# Altium project TEC_driver.PrjPCB (part 2 of 2)

## Sheet TEC.SchDoc
size A3; SPICEModelCacheKPBCKGMN: <root> / <DocumentId>KPBCKGMN</DocumentId> / </root>
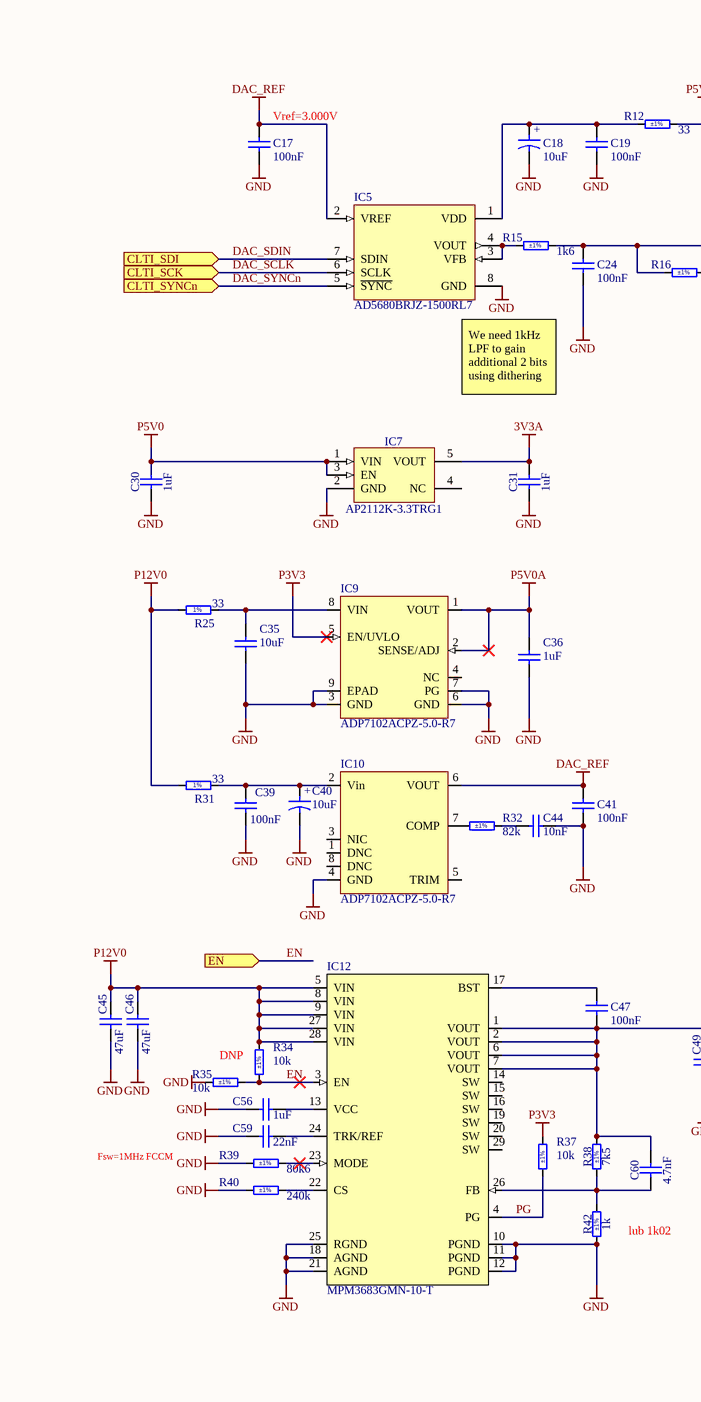
[diagram p2: TEC.SchDoc, left]
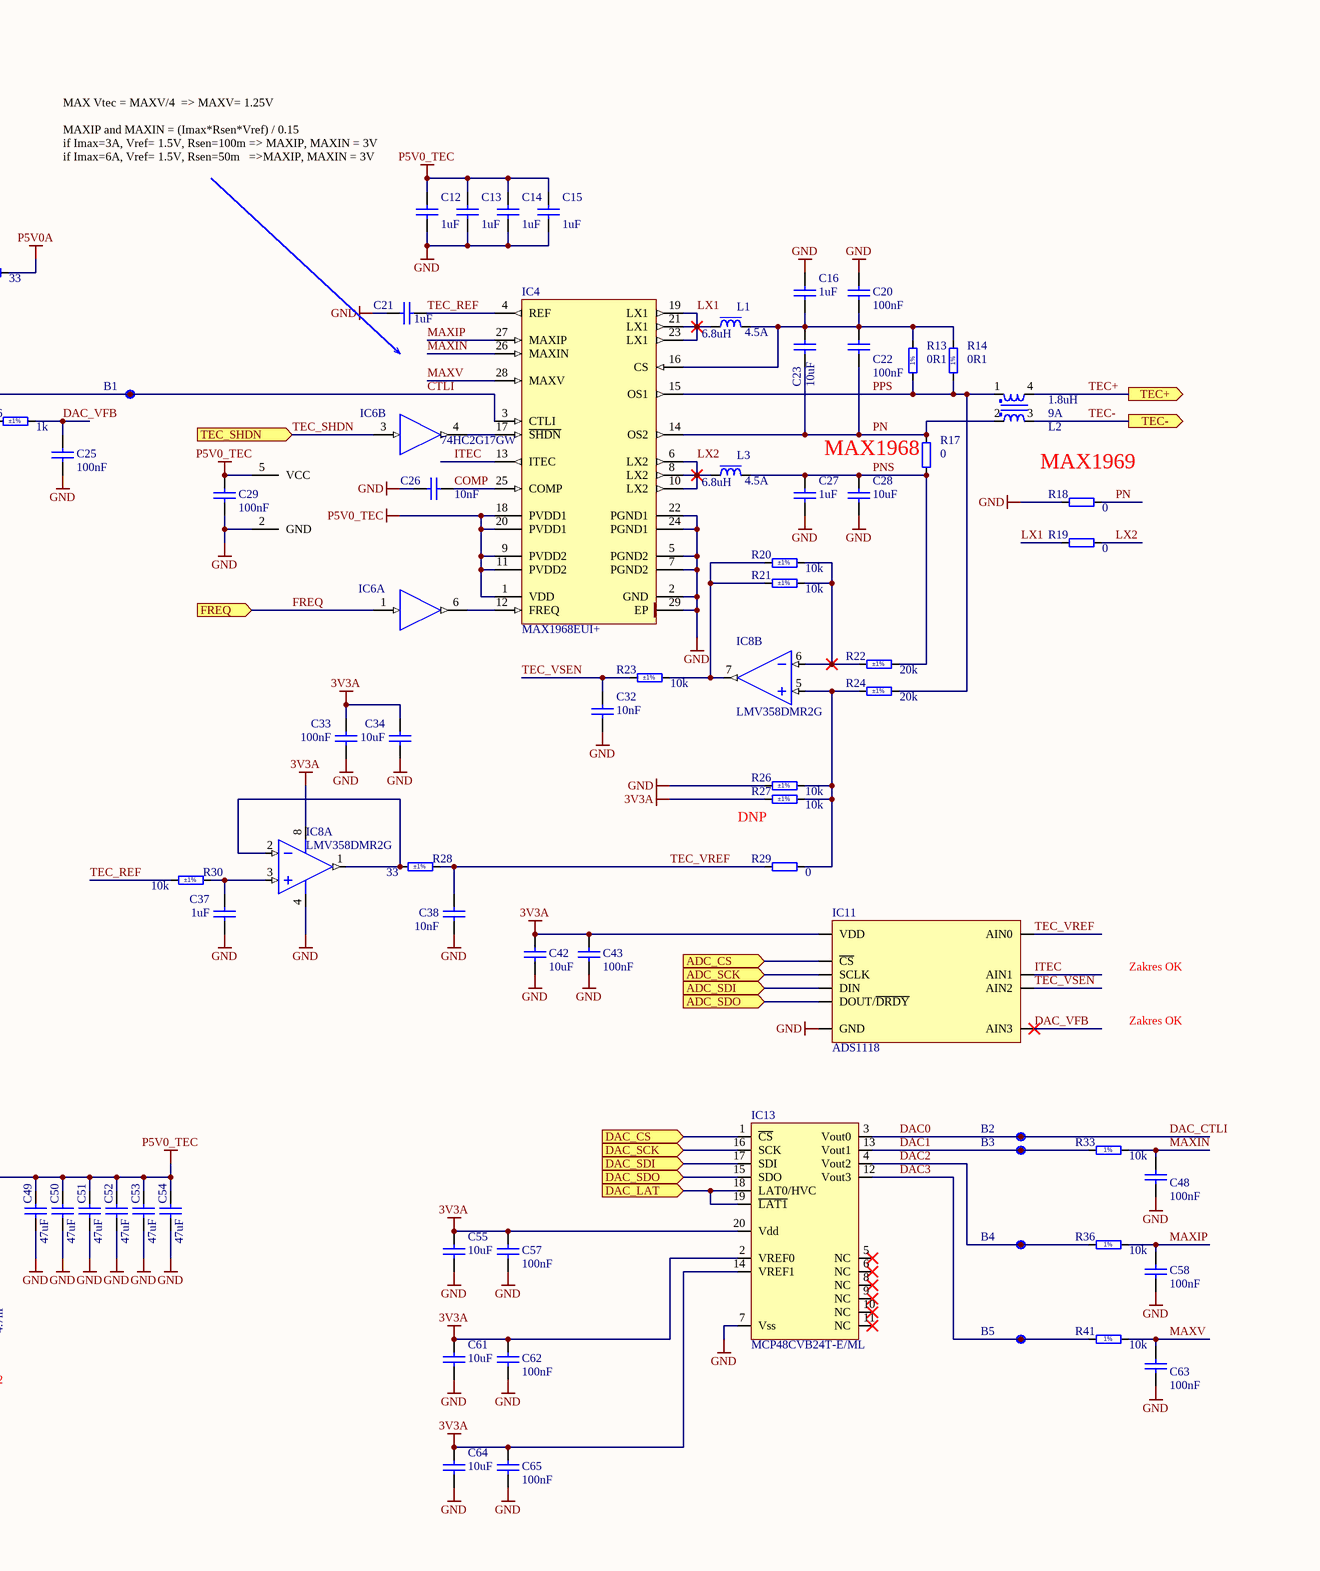
[diagram p3: TEC.SchDoc, right]

### Parts
B1  SMD Pad  [C100]  (value not drawn)
B2  SMD Pad  [C100]  (value not drawn)
B3  SMD Pad  [C100]  (value not drawn)
B4  SMD Pad  [C100]  (value not drawn)
B5  SMD Pad  [C100]  (value not drawn)
C12  1uF  [CAPC1005X55N]
C13  1uF  [CAPC1005X55N]
C14  1uF  [CAPC1005X55N]
C15  1uF  [CAPC1005X55N]
C16  1uF  [CAPC1005X55N]
C17  100nF  [CAPC1005X55N]
C18  10uF  [CAPMP3216X180N]
C19  100nF  [CAPC1005X55N]
C20  100nF  [CAPC1005X55N]
C21  1uF  [CAPC1005X55N]
C22  100nF  [CAPC1005X55N]
C23  10uF  [CAPC1709X100N]
C24  100nF  [CAPC1005X55N]
C25  100nF  [CAPC1005X55N]
C26  10nF  [CAPC1005X55N]
C27  1uF  [CAPC1005X55N]
C28  10uF  [CAPC1709X100N]
C29  100nF  [CAPC1005X55N]
C30  1uF  [CAPC1005X55N]
C31  1uF  [CAPC1005X55N]
C32  10nF  [CAPC1005X55N]
C33  100nF  [CAPC1005X55N]
C34  10uF  [CAPC1709X100N]
C35  10uF  [CAPC1709X100N]
C36  1uF  [CAPC1005X55N]
C37  1uF  [CAPC1005X55N]
C38  10nF  [CAPC1005X55N]
C39  100nF  [CAPC1005X55N]
C40  10uF  [CAPMP3216X180N]
C41  100nF  [CAPC1005X55N]
C42  10uF  [CAPC1709X100N]
C43  100nF  [CAPC1005X55N]
C44  10nF  [CAPC1005X55N]
C45  47uF  [CAPC3216X180N]
C46  47uF  [CAPC3216X180N]
C47  100nF  [CAPC1005X55N]
C48  100nF  [CAPC1005X55N]
C49  47uF  [CAPC3216X180N]
C50  47uF  [CAPC3216X180N]
C51  47uF  [CAPC3216X180N]
C52  47uF  [CAPC3216X180N]
C53  47uF  [CAPC3216X180N]
C54  47uF  [CAPC3216X180N]
C55  10uF  [CAPC1709X100N]
C56  1uF  [CAPC1005X55N]
C57  100nF  [CAPC1005X55N]
C58  100nF  [CAPC1005X55N]
C59  22nF  [CAPC1005X55N]
C60  4.7nF  [CAPC1005X55N]
C61  10uF  [CAPC1709X100N]
C62  100nF  [CAPC1005X55N]
C63  100nF  [CAPC1005X55N]
C64  10uF  [CAPC1709X100N]
C65  100nF  [CAPC1005X55N]
IC4  MAX1968EUI+  [SOP65P638X110-29N-R315X565]
IC5  AD5680BRJZ-1500RL7  [SOT65P280X145-8N]
IC6  74HC2G17GW  [SOT65P210X110-6N]  (value not drawn)  (parts A,B of 2)
IC7  AP2112K-3.3TRG1  [SOT95P285X140-5N]
IC8  LMV358DMR2G  [MSOP-8]  (parts A,B of 2)
IC9  ADP7102ACPZ-5.0-R7  [WFDFN-8]
IC10  ADP7102ACPZ-5.0-R7  [MSOP-8]
IC11  ADS1118  [VSSOP10]
IC12  MPM3683GMN-10-T  [MPM3683]
IC13  MCP48CVB24T-E/ML  [QFN20]
L1  6.8uH  Power: 4.5A  [INDM6965X300N]
L2  1.8uH  Power: 9A  [PA4339]
L3  6.8uH  Power: 4.5A  [INDM6965X300N]
R12  33  Tolerance: ±1%  [RESC1005X40N]
R13  0R1  [RESC3216X65N]
R14  0R1  [RESC3216X65N]
R15  1k6  Tolerance: ±1%  [RESC1005X40N]
R16  1k  Tolerance: ±1%  [RESC1005X40N]
R17  0  [RESC3116X80N]
R18  0  [RESC3116X80N]
R19  0  [RESC3116X80N]
R20  10k  Tolerance: ±1%  [RESC1005X40N]
R21  10k  Tolerance: ±1%  [RESC1005X40N]
R22  20k  Tolerance: ±1%  [RESC1005X40N]
R23  10k  Tolerance: ±1%  [RESC1005X40N]
R24  20k  Tolerance: ±1%  [RESC1005X40N]
R25  33  [RESC1005X40N]
R26  10k  Tolerance: ±1%  [RESC1005X40N]
R27  10k  Tolerance: ±1%  [RESC1005X40N]
R28  33  Tolerance: ±1%  [RESC1005X40N]
R29  0  [RESC1005X40N]
R30  10k  Tolerance: ±1%  [RESC1005X40N]
R31  33  [RESC1005X40N]
R32  82k  Tolerance: ±1%  [RESC1005X40N]
R33  10k  [RESC1005X40N]
R34  10k  Tolerance: ±1%  [RESC1005X40N]
R35  10k  Tolerance: ±1%  [RESC1005X40N]
R36  10k  [RESC1005X40N]
R37  10k  Tolerance: ±1%  [RESC1005X40N]
R38  7k5  Tolerance: ±1%  [RESC1005X40N]
R39  80k6  Tolerance: ±1%  [RESC1005X40N]
R40  240k  Tolerance: ±1%  [RESC1005X40N]
R41  10k  [RESC1005X40N]
R42  1k  Tolerance: ±1%  [RESC1005X40N]

### Ports
ADC_CS (in), ADC_SCK (in), ADC_SDI (in), ADC_SDO (in), CLTI_SCK (in), CLTI_SDI (in), CLTI_SYNCn (in), DAC_CS (in), DAC_LAT (in), DAC_SCK (in), DAC_SDI (in), DAC_SDO (in), EN (in), FREQ (in), TEC+ (out), TEC- (out), TEC_SHDN (in)

### Nets
3V3A: C31.2 C33.1 C34.2 C42.2 C43.1 C55.2 C57.1 C61.2 C62.1 C64.2 C65.1 IC7.5(VOUT) IC8.8(V+) IC11.8(VDD) IC13.2(VREF0) IC13.14(VREF1) IC13.20(Vdd) R27.1
DAC_REF: C17.1 C41.1 IC5.2(VREF) IC10.6(VOUT)
GND: C12.2 C13.2 C14.2 C15.2 C16.1 C17.2 C18.2 C19.2 C20.1 C21.2 C24.2 C25.2 C26.2 C27.2 C28.1 C29.2 C30.1 C31.1 C32.1 C33.2 C34.1 C35.1 C36.2 C37.2 C38.2 C39.2 C40.2 C41.2 C42.1 C43.2 C44.1 C45.1 C46.1 C48.2 C49.1 C50.1 C51.1 C52.1 C53.1 C54.1 C55.1 C56.2 C57.2 C58.2 C59.1 C61.1 C62.2 C63.2 C64.1 C65.2 IC4.2(GND) IC4.5(PGND2) IC4.7(PGND2) IC4.22(PGND1) IC4.24(PGND1) IC4.29(EP) IC5.8(GND) IC6.2(GND) IC7.2(GND) IC8.4(V-) IC9.3(GND) IC9.6(GND) IC9.7(PG) IC9.9(EPAD) IC10.4(GND) IC11.3(GND) IC12.10(PGND) IC12.11(PGND) IC12.12(PGND) IC12.18(AGND) IC12.21(AGND) IC12.25(RGND) IC13.7(Vss) R18.1 R26.1 R35.1 R39.1 R40.1 R42.1
P3V3: IC9.5(EN/UVLO) R37.2
P5V0: C30.2 IC7.1(VIN) IC7.3(EN)
P5V0_TEC: C12.1 C13.1 C14.1 C15.1 C29.1 C47.2 C49.2 C50.2 C51.2 C52.2 C53.2 C54.2 C60.2 IC4.1(VDD) IC4.9(PVDD2) IC4.11(PVDD2) IC4.18(PVDD1) IC4.20(PVDD1) IC6.5(VCC) IC12.1(VOUT) IC12.2(VOUT) IC12.6(VOUT) IC12.7(VOUT) R38.2
P5V0A: C36.1 IC9.1(VOUT) IC9.2(SENSE/ADJ) R12.2
P12V0: C45.2 C46.2 IC12.5(VIN) IC12.8(VIN) IC12.9(VIN) IC12.27(VIN) IC12.28(VIN) R25.1 R31.1 R34.2
VDD: IC6.5(VCC)
COMP: C26.1 IC4.25(COMP)
CS_ADC: IC11.2(~{CS}) ; port ADC_CS
CS_DAC: IC13.1(~{CS}) ; port DAC_CS
CTLI: B1.1 C24.1 IC4.3(CTLI) R15.2 R16.1
DAC0: B2.1 IC13.3(Vout0)  [also labelled DAC_CTLI]
DAC1: B3.1 IC13.13(Vout1) R33.1
DAC2: B4.1 IC13.4(Vout2) R36.1
DAC3: B5.1 IC13.12(Vout3) R41.1
DAC_SCLK: IC5.6(SCLK) IC11.1(SCLK) IC13.16(SCK) ; port DAC_SCK, port ADC_SCK, port CLTI_SCK
DAC_SDIN: IC5.7(SDIN) IC11.10(DIN) IC13.17(SDI) ; port DAC_SDI, port ADC_SDI, port CLTI_SDI
DAC_SYNCn: IC5.5(~{SYNC}) ; port CLTI_SYNCn  [project net CLTI_SYNCn]
DAC_VFB: C25.1 IC11.7(AIN3) R16.2
EN: IC12.3(EN) R34.1 R35.2 ; port EN
FREQ: IC6.1(IN) ; port FREQ
ITEC: IC4.13(ITEC) IC11.5(AIN1)
LAT_DAC: IC13.18(LAT0/HVC) IC13.19(~{LAT1}) ; port DAC_LAT
LX1: IC4.19(LX1) IC4.21(LX1) IC4.23(LX1) L1.1 R19.2
LX2: IC4.6(LX2) IC4.8(LX2) IC4.10(LX2) L3.1 R19.1
MAXIN: C48.1 IC4.26(MAXIN) R33.2
MAXIP: C58.1 IC4.27(MAXIP) R36.2
MAXV: C63.1 IC4.28(MAXV) R41.2
MISO_ADC: IC11.9(DOUT/~{DRDY}) ; port ADC_SDO
MISO_DAC: IC13.15(SDO) ; port DAC_SDO
PG: IC12.4(PG) R37.1
PN: C22.2 C23.1 IC4.14(OS2) L2.2 R17.2 R18.2
PNS: C27.1 C28.2 L3.2 R17.1 R22.2
PPS: IC4.15(OS1) L2.1 R13.1 R14.1 R24.2
TEC+: L2.4 ; port TEC+
TEC-: L2.3 ; port TEC-
TEC_REF: C21.1 IC4.4(REF) R30.2
TEC_SHDN: IC6.3(IN) ; port TEC_SHDN  [project net IO1]
TEC_VREF: C38.1 IC11.4(AIN0) R28.1 R29.1
TEC_VSEN: C32.2 IC11.6(AIN2) R23.1
NetC16_2: C16.2 C20.2 C22.1 C23.2 IC4.16(CS) L1.2 R13.2 R14.2
NetC18_1: C18.1 C19.1 IC5.1(VDD) R12.1
NetC35_2: C35.2 IC9.8(VIN) R25.2
NetC37_1: C37.1 IC8.3(IN1+) R30.1
NetC39_1: C39.1 C40.1 IC10.2(Vin) R31.2
NetC44_2: C44.2 R32.2
NetC47_1: C47.1 IC12.17(BST)
NetC56_1: C56.1 IC12.13(VCC)
NetC59_2: C59.2 IC12.24(TRK/REF)
NetC60_1: C60.1 IC12.26(FB) R38.1 R42.2
NetIC4_12: IC4.12(FREQ) IC6.6(OUT)
NetIC4_17: IC4.17(~{SHDN}) IC6.4(OUT)
NetIC5_3: IC5.3(VFB) IC5.4(VOUT) R15.1
NetIC8_1: IC8.1(OUT1) IC8.2(IN1-) R28.2
NetIC8_5: IC8.5(IN2+) R24.1 R26.2 R27.2 R29.2
NetIC8_6: IC8.6(IN2-) R20.2 R21.2 R22.1
NetIC8_7: IC8.7(OUT2) R20.1 R21.1 R23.2
NetIC10_7: IC10.7(COMP) R32.1
NetIC12_22: IC12.22(CS) R40.2
NetIC12_23: IC12.23(MODE) R39.2

Not connected (* = marked no-connect by the designer): IC7 4(NC); IC9 4(NC); IC10 1(DNC) 3(NIC) 5(TRIM) 8(DNC); IC12 14(SW) 15(SW) 16(SW) 19(SW) 20(SW) 29(SW); IC13 5(NC)* 6(NC)* 8(NC)* 9(NC)* 10(NC)* 11(NC)*

### Notes on the sheet
- MAX Vtec = MAXV/4  => MAXV= 1.25V
- MAXIP and MAXIN = (Imax*Rsen*Vref) / 0.15
- if Imax=3A, Vref= 1.5V, Rsen=100m => MAXIP, MAXIN = 3V
- if Imax=6A, Vref= 1.5V, Rsen=50m   =>MAXIP, MAXIN = 3V
- (near C17) Vref=3.000V
- (near R17) MAX1968
- MAX1969
- We need 1kHz LPF to gain additional 2 bits using dithering
- DNP
- Zakres OK
- Fsw=1MHz FCCM
- lub 1k02
- (in symbol CTE3216-18_10UF_16V_20%_AVX_TCJ) +
- (in symbol R0402_10K_1%_0.0625W_100PPM) 1%
- (in symbol R0402_33R_1%_0.0625W_100PPM) 1%
- (in symbol R1206_0R1_1%_0.25W_100PPM_YAGEO_PT) 1%

### Library data of the parts
B1-B5 = SMD_PAD_D1MM: Through Hole Pad; Part Description: 1mm Diameter SMD Pad; Mounted: No; Part Number: SMD_PAD_D1MM; Component Kind: Standard (No BOM); Component Type: Standard (No BOM); Pin Count: 1; Family: SMD Pad; Socket: No; SMD: No; Sense: No; Status: None; ComponentHeight: 0mm; HelpURL: Undefined; Author: CERN DEM JLC; CreateDate: 10.10.2017; LatestRevisionDate: 10.10.2017; PackageDescription: 1mm Diameter SMD Pad
C12-C16 C21 C27 C36 C37 C56 = CC0402_1UF_25V_10%_X5R: Non-polarised capacitor; Part Description: SMD Multilayer Chip Ceramic Capacitor; Manufacturer: GENERIC; Manufacturer1 Part Number: C1005X5R1E105K050; Voltage: 25V; TC: X5R; Tolerance: ±10%; Part Number: CC0402_1UF_25V_10%_X5R; Component Kind: Standard; Component Type: Standard; Pin Count: 2; Value: 1uF; Status: Preferred; Manufacturer Part Number: CC0402_1UF_25V_10%_X5R; Case: 0402; Mounted: Yes; Socket: No; SMD: Yes; Sense: No; Manufacturer1 Example: TDK; Manufacturer1 ComponentHeight: 0.55mm; HelpURL: \\cern.ch\dfs\Applications\Altium\Datasheets\CC0402_X5R_TDK_C.pdf; Author: CERN DEM BC; CreateDate: 17.02.2020; LatestRevisionDate: 17.02.2020
C17 C19 C20 C22 C24 C25 C29 C33 C39 C41 C43 C47 C48 C57 C58 C62 C63 C65 = CC0402_100NF_16V_10%_X5R: Non-polarised capacitor; Part Description: SMD Multilayer Chip Ceramic Capacitor; Manufacturer: GENERIC; Manufacturer1 Part Number: GRM155R61C104KA88D; Voltage: 16V; TC: X5R; Tolerance: ±10%; Table: Capacitors SMD; Part Number: CC0402_100NF_16V_10%_X5R; Component Kind: Standard; Component Type: Standard; Pin Count: 2; Value: 100nF; Status: None; Manufacturer Part Number: CC0402_100NF_16V_10%_X5R; Case: 0402; Mounted: Yes; Socket: No; SMD: Yes; Manufacturer1 Example: MURATA; Manufacturer1 ComponentHeight: 0.55mm; HelpURL: \\cern.ch\dfs\Applications\Altium\Datasheets\CC0402_X5R_MURATA_GRM.pdf; Author: CERN DEM JLC; CreateDate: 2013-12-10; LatestRevisionDate: 2013-12-10
C18 C40 = CTE3216-18_10UF_16V_20%_AVX_TCJ: Polarised capacitor; Part Description: ESR 0R200 Tantalum Solid Electrolytic Chip Capacitor with Conductive Polymer Electrode; Manufacturer: AVX; Manufacturer Part Number: TCJA106M016R0200; Voltage: 16V; Tolerance: ±20%; Part Number: CTE3216-18_10UF_16V_20%_AVX_TCJ; Component Kind: Standard; Component Type: Standard; Pin Count: 2; Value: 10uF; Status: Preferred; Case: A; Mounted: Yes; Socket: No; SMD: Yes; Sense: No; ComponentHeight: 1.8mm; HelpURL: \\cern.ch\dfs\Applications\Altium\Datasheets\CTE_AVX_TCJ.pdf; Author: CERN DEM JLC; CreateDate: 29.03.2012; LatestRevisionDate: 29.03.2012
C23 C28 C34 C35 C42 C55 C61 C64 = CC0603_10UF_6.3V_20%_X7R_SAMSUNG_CL: Non-polarised capacitor; Part Description: SMD Multilayer Chip Ceramic Capacitor; Manufacturer: SAMSUNG ELECTRO-MECHANICS; Manufacturer Part Number: CL10B106MQ8NR; Voltage: 6.3V; TC: X7R; Tolerance: ±20%; Part Number: CC0603_10UF_6.3V_20%_X7R_SAMSUNG_CL; Component Kind: Standard; Component Type: Standard; Pin Count: 2; Value: 10uF; Status: Not Recommended; Case: 0603; Mounted: Yes; Socket: No; SMD: Yes; Sense: No; ComponentHeight: 1mm; HelpURL: \\cern.ch\dfs\Applications\Altium\Datasheets\CC0603_X7R_SAMSUNG_CL10B106MQ8NR.pdf; Author: CERN DEM BC; CreateDate: 12.10.2020; LatestRevisionDate: 12.10.2020
C26 C32 C38 C44 = CC0402_10NF_50V_10%_X7R: Non-polarised capacitor; Part Description: SMD Multilayer Chip Ceramic Capacitor; Manufacturer: GENERIC; Manufacturer1 Part Number: GRM155R71H103KA88D; Voltage: 50V; TC: X7R; Tolerance: ±10%; Part Number: CC0402_10NF_50V_10%_X7R; Component Kind: Standard; Component Type: Standard; Pin Count: 2; Value: 10nF; Status: None; Manufacturer Part Number: CC0402_10NF_50V_10%_X7R; Case: 0402; Mounted: Yes; Socket: No; SMD: Yes; Sense: No; Manufacturer1 Example: MURATA; Manufacturer1 ComponentHeight: 0.55mm; HelpURL: \\cern.ch\dfs\Applications\Altium\Datasheets\CC0402_X7R_MURATA_GRM.pdf; Author: CERN DEM MR; CreateDate: 08.01.2016; LatestRevisionDate: 08.01.2016
C30 C31 = CC0402_1UF_16V_10%_X5R: Non-polarised capacitor; Part Description: SMD Multilayer Chip Ceramic Capacitor; Manufacturer: GENERIC; Manufacturer1 Part Number: C1005X5R1C105KT; Voltage: 16V; TC: X5R; Tolerance: ±10%; Part Number: CC0402_1UF_16V_10%_X5R; Component Kind: Standard; Component Type: Standard; Pin Count: 2; Value: 1uF; Status: Preferred; Manufacturer Part Number: CC0402_1UF_16V_10%_X5R; Case: 0402; Mounted: Yes; Socket: No; SMD: Yes; Sense: No; Manufacturer1 Example: TDK; Manufacturer1 ComponentHeight: 0.55mm; HelpURL: \\cern.ch\dfs\Applications\Altium\Datasheets\CC0402_X5R_TDK_C.pdf; Author: CERN DEM JLC; CreateDate: 25.10.2012; LatestRevisionDate: 25.10.2012
C45 C46 C49-C54 = CC1206_47UF_25V_20%_X5R: Non-polarised capacitor; Part Description: SMD Multilayer Chip Ceramic Capacitor; Manufacturer: GENERIC; Manufacturer1 Part Number: C3216X5R1E476M160; Voltage: 25V; TC: X5R; Tolerance: ±20%; Part Number: CC1206_47UF_25V_20%_X5R; Component Kind: Standard; Component Type: Standard; Pin Count: 2; Value: 47uF; Status: None; Manufacturer Part Number: CC1206_47UF_25V_20%_X5R; Case: 1206; Mounted: Yes; Socket: No; SMD: Yes; Sense: No; Manufacturer1 Example: TDK; Manufacturer1 ComponentHeight: 1.8mm; HelpURL: \\cern.ch\dfs\Applications\Altium\Datasheets\CC1206_X5R_TDK_C.pdf; Author: CERN DEM JLC; CreateDate: 20.11.2013; LatestRevisionDate: 14.03.2017
C59 = CC0402_22NF_50V_5%_X7R: Non-polarised capacitor; Part Description: SMD Multilayer Chip Ceramic Capacitor; Manufacturer: GENERIC; Manufacturer1 Part Number: C0402C223J5RAC; Voltage: 50V; TC: X7R; Tolerance: ±5%; Part Number: CC0402_22NF_50V_5%_X7R; Component Kind: Standard; Component Type: Standard; Pin Count: 2; Value: 22nF; Status: Preferred; Manufacturer Part Number: CC0402_22NF_50V_5%_X7R; Case: 0402; Mounted: Yes; Socket: No; SMD: Yes; Sense: No; Manufacturer1 Example: KEMET; Manufacturer1 ComponentHeight: 0.55mm; HelpURL: \\cern.ch\dfs\Applications\Altium\Datasheets\CC0402_X7R_KEMET.pdf; Author: CERN DEM BC; CreateDate: 15.07.2020; LatestRevisionDate: 15.07.2020
C60 = CC0402_4.7NF_16V_10%_X7R: Non-polarised capacitor; Part Description: SMD Multilayer Chip Ceramic Capacitor; Manufacturer: GENERIC; Manufacturer1 Part Number: 223878715632; Voltage: 16V; TC: X7R; Tolerance: ±10%; Part Number: CC0402_4.7NF_16V_10%_X7R; Component Kind: Standard; Component Type: Standard; Pin Count: 2; Value: 4.7nF; Status: Not Recommended; Manufacturer Part Number: CC0402_4.7NF_16V_10%_X7R; Case: 0402; Mounted: Yes; Socket: No; SMD: Yes; Sense: No; Manufacturer1 Example: PHYCOMP; Manufacturer1 ComponentHeight: 0.55mm; HelpURL: \\cern.ch\dfs\Applications\Altium\Datasheets\CC0402_X7R_PHYCOMP.pdf; Author: CERN DEM JLC; CreateDate: 03.12.2007; LatestRevisionDate: 03.12.2007
IC4 = MAX1968EUI+: Power Drivers for Peltier TEC Modules; Manufacturer: MAXIM; PressFit: No; Bonding: No; Part Number: MAX1968EUI+; Component Kind: Standard; Component Type: Standard; Device: MAX1968EUI+; PackageDescription: SOP, 0.65mm Pitch; 28 Pin, 4.40mm W X 9.75mm L X 1.10mm H body (w/Thermal Tab 3.15 X 5.65mm), IPC Medium Density; Part Description: Power Drivers for Peltier TEC Modules; Manufacturer Part Number: MAX1968EUI; Pin Count: 29; Case: TSSOP28; Mounted: Yes; Socket: No; SMD: Yes; Sense: No; ComponentHeight: 1.1mm; Author: CERN DEM BC; HelpURL: \\cern.ch\dfs\Applications\Altium\Datasheets\MAX1968EUI+.pdf; CreateDate: 01.04.2021; LatestRevisionDate: 04.04.2022
IC5 = DAC_AD5680BRJZ: 5V 18-Bit nanoDAC®in a SOT-23; Manufacturer: ANALOG DEVICES; PressFit: No; Bonding: No; Part Number: AD5680BRJZ-1500RL7; Component Kind: Standard; Component Type: Standard; Device: AD5680BRJZ-1500RL7; Footprint: TSOP65P280X145-8N; PackageDescription: TSOP, 8-Leads, Body 2,90x1,60mm, Pitch 0,65mm, IPC Medium Density; Part Description: 5V 18-Bit nanoDAC®in a SOT-23; Manufacturer Part Number: AD5680BRJZ-1500RL7; Pin Count: 17; Case: SOT-23-8; Mounted: Yes; Socket: No; SMD: Yes; Sense: No; ComponentHeight: 0.8mm; Author: GK; HelpURL: \\cern.ch\dfs\Applications\Altium\Datasheets\AD5686BCPZ.pdf; CreateDate: 21.08.2017; LatestRevisionDate: 21.08.2017
IC6 = 74HC2G17GW: Dual Schmitt-Trigger Buffer; Part Description: Dual non-inverting Schmitt trigger; Manufacturer: NEXPERIA; PressFit: No; Bonding: No; Part Number: 74HC2G17GW; Component Kind: Standard; Component Type: Standard; Device: 74HC2G17GW; PackageDescription: SOT363, SC70-6, 0.65mm Pitch; 6 pin, 1.25mm W X 2.00mm L X 1.10mm H body, IPC Medium Density; Manufacturer Part Number: 74HC2G17GW; Pin Count: 6; Case: SOT363; Mounted: Yes; Socket: No; SMD: Yes; Sense: No; ComponentHeight: 1.1mm; Author: CERN DEM HF; HelpURL: \\cern.ch\dfs\Applications\Altium\Datasheets\74HC2G17.pdf; CreateDate: 31.10.2023; LatestRevisionDate: 31.10.2023
IC7 = AP2112K-3.3TRG1: 600mA CMOS Low Dropout Linear Regulator with Enable; Part Description: 3.3V 600mA CMOS Low Dropout Linear Regulator with Enable; Manufacturer: DIODES INCORPORATED; PressFit: No; Bonding: No; Part Number: AP2112K-3.3TRG1; Component Kind: Standard; Component Type: Standard; Device: AP2112K-3.3TRG1; PackageDescription: SOT23, 0.95mm Pitch; 5 Pin, 1.6mm W X 3.0mm L X 1.40mm H body, IPC Medium Density; Manufacturer Part Number: AP2112K-3.3; Pin Count: 5; Case: SOT25; Mounted: Yes; Socket: No; SMD: Yes; Sense: No; ComponentHeight: 1.4mm; HelpURL: \\cern.ch\dfs\Applications\Altium\Datasheets\AP2112K-3.3TRG1.pdf; Author: CERN DEM MR; CreateDate: 13.12.2017; LatestRevisionDate: 27.06.2022
IC8 = LMV358DMR2G: Voltage Feedback Amplifier 2 Circuit Rail-to-Rail 8-MSOP; Manufacture: onsemi; Parameter1: Bandwidth; Parameter2: Vmax; Shop1: Digi-Key; Shop1ID: LMV358DMR2GOSTR-ND; Value1: 1MHz; Value2: 5.5V; ComponentSymbol: LMV358DMR2G; ComponentType: IC OPAMP; DafaultFootprint: MSOP-8; MTBF: *; MTTF: *; ComponentLink3Description: DataSheet; ComponentLink3URL: https://www.onsemi.com/pdf/datasheet/lmv321-d.pdf
IC9 = ADP7102ACPZ-5.0-R7: Linear Voltage Regulator IC Positive Fixed 1 Output 300mA 8-LFCSP-WD (3x3); Manufacture: Analog Devices; Tolerance1: ± %; Value1: 3.3V to 20.0V; Assembly: SMD; Value2: 5.0V; Parameter1: Input Range; Parameter2: Output Voltage; Parameter3: Output Current; ComponentLink1URL: https://www.analog.com/media/en/technical-documentation/data-sheets/ADP7102.pdf; ComponentLink1Description: Datasheet; Shop1: *; Shop1ID: *; ComponentType: *; DafaultFootprint: WFDFN-8; Replacement: *; ComponentSymbol: ADP7102ACPZ-5.0-R7; Tolerance2: ± %; Value3: 300mA
IC10 = ADR433ARMZ: Series Voltage Reference IC Fixed 3V V ±0.13% 30 mA 8-MSOP; Manufacture: Analog Devices; Tolerance1: ± %; Value1: 3.3V to 20.0V; DafaultFootprint: WFDFN-8; Assembly: SMD; Value2: 5.0V; Parameter1: Input Range; Parameter2: Output Voltage; Value3: 300mA; Parameter3: Output Current; ComponentLink1URL: https://www.analog.com/media/en/technical-documentation/data-sheets/ADP7102.pdf; ComponentLink1Description: Datasheet; Shop1: *; Shop1ID: *; ComponentType: *; Replacement: *; ComponentSymbol: ADP7102ACPZ-5.0-R7; Tolerance2: ± %
IC11 = ADS1118: ADS1118 Ultrasmall, Low-Power, SPI™-Compatible, 16-Bit  Analog-to-Digital Converter with Internal Reference and Temperature Sensor; Manufacture: TexasInstruments; Assembly: SMD; DafaultFootprint: VSSOP-10; X2QFN-10; Parameter1: Resolution; Value1: 16bit; ComponentLink1Description: Datasheet; ComponentLink1URL: http://www.ti.com/lit/ds/symlink/ads1118.pdf; ComponentLink2Description: AplicationNote; ComponentSymbol: ADS1118; ComponentType: IC ADC
IC12 = MPM3683GMN-10-T: Non-Isolated PoL Module DC DC Converter 1 Output 0.6 ~ 5.5V 10A 2.7V - 16V Input; Manufacture: Monolithic Power Systems Inc.; Assembly: SMD; DafaultFootprint: 29-LGA Module; Parameter1: Input Voltage; Parameter2: Iout; Parameter3: Vin; Replacement: Vout; Shop1: Digi-Key; Shop1ID: 1589-MPM3683GMN-10-T-ND; Value3: 0.6-5.5V; ComponentLink1Description: Datasheet; ComponentLink1URL: https://www.monolithicpower.com/en/documentview/productdocument/index/version/2/document_type/Datasheet/lang/en/sku/MPM3683GMN-10/document_id/9917/; ComponentSymbol: MPM3683GMN-10-T; ComponentType: IC; Tolerance1: *; Tolerance2: *; Value1: 2.7V-16V; Value2: 10A
IC13 = MCP48CVB24T-E/ML: 12 Bit Digital to Analog Converter 4 20-QFN (4x4); Manufacture: Microchip; Tolerance1: ± %; Value1: 12bit; Shop1: Digi-Key; Shop1ID: 150-MCP48CVB24T-E/MLTR-ND; Assembly: SMD; Value2: 2.7-5.5V; Parameter1: Resolution; Parameter2: Operation voltage; ComponentLink1URL: https://mm.digikey.com/Volume0/opasdata/d220001/medias/docus/4284/MCP48CxBx4_8_2021.pdf; ComponentLink1Description: Datasheet; ComponentType: IC; DafaultFootprint: 20-QFN; Replacement: *; ComponentSymbol: MCP48CVB24T-E/ML; Tolerance2: ± %
L1 L3 = IND2525_6.8UH_20%_VISHAY_IHLP-2525CZ-01: Inductor With Core; Part Description: Low Profile, High Current IHLP® Inductor; Manufacturer: VISHAY DALE; Manufacturer Part Number: IHLP2525CZER6R8M01; Resistance: 0.054R; Tolerance: ±20%; Part Number: IND2525_6.8UH_20%_VISHAY_IHLP-2525CZ-01; Component Kind: Standard; Component Type: Standard; Pin Count: 2; Value: 6.8uH; Status: None; Case: 2525; Mounted: Yes; Socket: No; SMD: Yes; Sense: No; ComponentHeight: 3mm; HelpURL: \\cern.ch\dfs\Applications\Altium\Datasheets\IND2525_VISHAY_IHLP-2525CZ-01.pdf; Author: CERN DEM MR; CreateDate: 29/06/2017; LatestRevisionDate: 29/06/2017
L2 = PA4339.101NLT: 1.8 µH @ 100 kHz 2 Line Common Mode Choke Surface Mount 140 Ohms @ 100 MHz 9A DCR 10mOhm; Part Description: Line Filter, Common Mode Choke; Manufacturer: PULSE; Resistance: 0.010R; Tolerance: ±50%; Part Number: PA4339.101NLT; Component Kind: Standard; Component Type: Standard; Footprint: IND_PULSE_PA4339; Pin Count: 4; Value: 1.8uH; Status: None; Manufacturer Part Number: PA4339.101NLT; Mounted: Yes; Socket: No; SMD: Yes; Sense: No; ComponentHeight: 3.8; HelpURL: \\cern.ch\dfs\Applications\Altium\Datasheets\IND_BOURNS_SRF0504.pdf; Author: GK; CreateDate: 07/08/2017; LatestRevisionDate: 07/08/2017; Parameter 1: *
R12 R25 R28 R31 = R0402_33R_1%_0.0625W_100PPM: Resistor - 1%; Part Description: General Purpose Thick Film Chip Resistor; Manufacturer: GENERIC; Manufacturer1 Part Number: 232270673309L; TC: ±100ppm/°C; PressFit: No; Part Number: R0402_33R_1%_0.0625W_100PPM; Component Kind: Standard; Component Type: Standard; Pin Count: 2; Value: 33; Status: Not Recommended; Power: 0.0625W; Manufacturer Part Number: R0402_33R_1%_0.0625W_100PPM; Case: 0402; Mounted: Yes; Sense: No; Socket: No; SMD: Yes; Manufacturer1 Example: YAGEO PHYCOMP; Manufacturer1 ComponentHeight: 0.4mm; HelpURL: \\cern.ch\dfs\Applications\Altium\Datasheets\R0402_Phycomp_RC0402.pdf; Author: CERN DEM JLC
  R12 R28: CreateDate: 03.12.2007; LatestRevisionDate: 17.10.2012
  R25 R31: Tolerance: ±1%; CreateDate: 03/12/2007; LatestRevisionDate: 17/10/2012
R13 R14 = R1206_0R1_1%_0.25W_100PPM_YAGEO_PT: Resistor - 1%; Part Description: Current Sensor, Low TCR Chip Resistor; Manufacturer: YAGEO PHYCOMP; Manufacturer Part Number: PT1206FR-070R1L; Power: 0.25W; TC: ±100ppm/°C; PressFit: No; Part Number: R1206_0R1_1%_0.25W_100PPM_YAGEO_PT; Component Kind: Standard; Component Type: Standard; Pin Count: 2; Value: 0R1; Status: None; Tolerance: ±1%; Case: 1206; Mounted: Yes; Sense: No; Socket: No; SMD: Yes; ComponentHeight: 0.65mm; HelpURL: \\cern.ch\dfs\Applications\Altium\Datasheets\R1206_YAGEO_PT.pdf; Author: CERN DEM JMW; CreateDate: 06/07/2015; LatestRevisionDate: 06/07/2015
R15 = R0402_1K6_1%_0.0625W_100PPM: Resistor - 1%; Part Description: General Purpose Thick Film Chip Resistor; Manufacturer: GENERIC; Manufacturer1 Part Number: 232270671602L; TC: ±100ppm/°C; PressFit: No; Part Number: R0402_1K6_1%_0.0625W_100PPM; Component Kind: Standard; Component Type: Standard; Pin Count: 2; Value: 1k6; Status: Not Recommended; Power: 0.0625W; Manufacturer Part Number: R0402_1K6_1%_0.0625W_100PPM; Case: 0402; Mounted: Yes; Sense: No; Socket: No; SMD: Yes; Manufacturer1 Example: YAGEO PHYCOMP; Manufacturer1 ComponentHeight: 0.4mm; HelpURL: \\cern.ch\dfs\Applications\Altium\Datasheets\R0402_Phycomp_RC0402.pdf; Author: CERN DEM JLC; CreateDate: 03.12.2007; LatestRevisionDate: 17.10.2012
R16 R42 = R0402_1K_1%_0.0625W_100PPM: Resistor - 1%; Part Description: General Purpose Thick Film Chip Resistor; Manufacturer: GENERIC; Manufacturer1 Part Number: 232270671002L; TC: ±100ppm/°C; PressFit: No; Part Number: R0402_1K_1%_0.0625W_100PPM; Component Kind: Standard; Component Type: Standard; Pin Count: 2; Value: 1k; Status: Not Recommended; Power: 0.0625W; Manufacturer Part Number: R0402_1K_1%_0.0625W_100PPM; Case: 0402; Mounted: Yes; Sense: No; Socket: No; SMD: Yes; Manufacturer1 Example: YAGEO PHYCOMP; Manufacturer1 ComponentHeight: 0.4mm; HelpURL: \\cern.ch\dfs\Applications\Altium\Datasheets\R0402_Phycomp_RC0402.pdf; Author: CERN DEM JLC; CreateDate: 03.12.2007; LatestRevisionDate: 17.10.2012
R17-R19 = R1206_0R_JUMPER_SEI_HCJ: Resistor; Part Description: 38.7A (0.0005R Max DC Resistance) Zero Ohm Jumper; Manufacturer: SEI (STACKPOLE ELECTRONICS INC.); Manufacturer Part Number: HCJ1206ZT0R00; PressFit: No; Part Number: R1206_0R_JUMPER_SEI_HCJ; Component Kind: Standard; Component Type: Standard; Pin Count: 2; Value: 0; Status: Not Recommended; Case: 1206; Mounted: Yes; Sense: No; Socket: No; SMD: Yes; HelpURL: \\cern.ch\dfs\Applications\Altium\Datasheets\R1206_SEI_HCJ.pdf; Author: CERN DEM MR; CreateDate: 20.02.2018; LatestRevisionDate: 20.02.2018; ComponentHeight: 0.8mm
R20 R21 R23 R26 R27 R30 R33-R37 R41 = R0402_10K_1%_0.0625W_100PPM: Resistor - 1%; Part Description: General Purpose Thick Film Chip Resistor; Manufacturer: GENERIC; Manufacturer1 Part Number: 232270671003L; TC: ±100ppm/°C; PressFit: No; Part Number: R0402_10K_1%_0.0625W_100PPM; Component Kind: Standard; Component Type: Standard; Pin Count: 2; Value: 10k; Status: Not Recommended; Power: 0.0625W; Manufacturer Part Number: R0402_10K_1%_0.0625W_100PPM; Case: 0402; Mounted: Yes; Sense: No; Socket: No; SMD: Yes; Manufacturer1 Example: YAGEO PHYCOMP; Manufacturer1 ComponentHeight: 0.4mm; HelpURL: \\cern.ch\dfs\Applications\Altium\Datasheets\R0402_Phycomp_RC0402.pdf; Author: CERN DEM JLC
  R20 R21 R23 R26 R27 R30 R34 R35 R37: CreateDate: 03.12.2007; LatestRevisionDate: 17.10.2012
  R33 R36 R41: Tolerance: ±1%; CreateDate: 03/12/2007; LatestRevisionDate: 17/10/2012
R22 R24 = R0402_20K_1%_0.0625W_100PPM: Resistor - 1%; Part Description: General Purpose Thick Film Chip Resistor; Manufacturer: GENERIC; Manufacturer1 Part Number: 232270672003L; TC: ±100ppm/°C; PressFit: No; Part Number: R0402_20K_1%_0.0625W_100PPM; Component Kind: Standard; Component Type: Standard; Pin Count: 2; Value: 20k; Status: Not Recommended; Power: 0.0625W; Manufacturer Part Number: R0402_20K_1%_0.0625W_100PPM; Case: 0402; Mounted: Yes; Sense: No; Socket: No; SMD: Yes; Manufacturer1 Example: YAGEO PHYCOMP; Manufacturer1 ComponentHeight: 0.4mm; HelpURL: \\cern.ch\dfs\Applications\Altium\Datasheets\R0402_Phycomp_RC0402.pdf; Author: CERN DEM JLC; CreateDate: 03.12.2007; LatestRevisionDate: 17.10.2012
R29 = R0402_0R_JUMPER: Resistor; Part Description: 1A (0.05R Max DC Resistance) Zero Ohm Jumper; Manufacturer: GENERIC; Manufacturer1 Part Number: 232270591001L; PressFit: No; Part Number: R0402_0R_JUMPER; Component Kind: Standard; Component Type: Standard; Pin Count: 2; Value: 0; Status: Not Recommended; Manufacturer Part Number: R0402_0R_JUMPER; Case: 0402; Mounted: Yes; Sense: No; Socket: No; SMD: Yes; Manufacturer1 Example: YAGEO PHYCOMP; Manufacturer1 ComponentHeight: 0.4mm; HelpURL: \\cern.ch\dfs\Applications\Altium\Datasheets\R0402_Phycomp_RC0402.pdf; Author: CERN DEM JLC; CreateDate: 03.12.2007; LatestRevisionDate: 17.10.2012
R32 = R0402_82K_1%_0.0625W_100PPM: Resistor - 1%; Part Description: General Purpose Thick Film Chip Resistor; Manufacturer: GENERIC; Manufacturer1 Part Number: 232270678203L; TC: ±100ppm/°C; PressFit: No; Part Number: R0402_82K_1%_0.0625W_100PPM; Component Kind: Standard; Component Type: Standard; Pin Count: 2; Value: 82k; Status: Not Recommended; Power: 0.0625W; Manufacturer Part Number: R0402_82K_1%_0.0625W_100PPM; Case: 0402; Mounted: Yes; Sense: No; Socket: No; SMD: Yes; Manufacturer1 Example: YAGEO PHYCOMP; Manufacturer1 ComponentHeight: 0.4mm; HelpURL: \\cern.ch\dfs\Applications\Altium\Datasheets\R0402_Phycomp_RC0402.pdf; Author: CERN DEM JLC; CreateDate: 03.12.2007; LatestRevisionDate: 17.10.2012
R38 = R0402_7K5_1%_0.0625W_100PPM: Resistor - 1%; Part Description: General Purpose Thick Film Chip Resistor; Manufacturer: GENERIC; Manufacturer1 Part Number: 232270677502L; TC: ±100ppm/°C; PressFit: No; Part Number: R0402_7K5_1%_0.0625W_100PPM; Component Kind: Standard; Component Type: Standard; Pin Count: 2; Value: 7k5; Status: Not Recommended; Power: 0.0625W; Manufacturer Part Number: R0402_7K5_1%_0.0625W_100PPM; Case: 0402; Mounted: Yes; Sense: No; Socket: No; SMD: Yes; Manufacturer1 Example: YAGEO PHYCOMP; Manufacturer1 ComponentHeight: 0.4mm; HelpURL: \\cern.ch\dfs\Applications\Altium\Datasheets\R0402_Phycomp_RC0402.pdf; Author: CERN DEM JLC; CreateDate: 03.12.2007; LatestRevisionDate: 17.10.2012
R39 = R0402_80K6_1%_0.0625W_100PPM: Resistor - 1%; Part Description: General Purpose Thick Film Chip Resistor; Manufacturer: GENERIC; Manufacturer1 Part Number: CRCW040280K6FK; TC: ±100ppm/°C; PressFit: No; Part Number: R0402_80K6_1%_0.0625W_100PPM; Component Kind: Standard; Component Type: Standard; Pin Count: 2; Value: 80k6; Status: None; Power: 0.0625W; Manufacturer Part Number: R0402_80K6_1%_0.0625W_100PPM; Case: 0402; Mounted: Yes; Sense: No; Socket: No; SMD: Yes; Manufacturer1 Example: VISHAY; Manufacturer1 ComponentHeight: 0.4mm; HelpURL: \\cern.ch\dfs\Applications\Altium\Datasheets\R0402_VISHAY_CRCW.pdf; Author: CERN DEM HF; CreateDate: 25.11.2024; LatestRevisionDate: 25.11.2024
R40 = R0402_240K_1%_0.0625W_100PPM: Resistor - 1%; Part Description: General Purpose Thick Film Chip Resistor; Manufacturer: GENERIC; Manufacturer1 Part Number: 232270672404L; TC: ±100ppm/°C; PressFit: No; Part Number: R0402_240K_1%_0.0625W_100PPM; Component Kind: Standard; Component Type: Standard; Pin Count: 2; Value: 240k; Status: Not Recommended; Power: 0.0625W; Manufacturer Part Number: R0402_240K_1%_0.0625W_100PPM; Case: 0402; Mounted: Yes; Sense: No; Socket: No; SMD: Yes; Manufacturer1 Example: YAGEO PHYCOMP; Manufacturer1 ComponentHeight: 0.4mm; HelpURL: \\cern.ch\dfs\Applications\Altium\Datasheets\R0402_Phycomp_RC0402.pdf; Author: CERN DEM JLC; CreateDate: 03.12.2007; LatestRevisionDate: 17.10.2012

## Nets that join several sheets
GND: TEC_driver (MP1.1 MP2.1 MP3.1 R2.2), SPI_IFC (45 pins), TEC (79 pins)
P3V3: TEC_driver (R1.1), SPI_IFC (17 pins), TEC (IC9.5 R37.2)
P5V0: SPI_IFC (9 pins), TEC (C30.2 IC7.1 IC7.3)
P12V0: SPI_IFC (5 pins), TEC (10 pins)
CLTI_SYNCn: SPI_IFC (IC1.38), TEC (IC5.5)
CS_ADC: SPI_IFC (IC1.51), TEC (IC11.2)
CS_DAC: SPI_IFC (IC1.50), TEC (IC13.1)
DAC_SCLK: SPI_IFC (IC1.48), TEC (IC5.6 IC11.1 IC13.16)
DAC_SDIN: SPI_IFC (IC1.49), TEC (IC5.7 IC11.10 IC13.17)
EN: SPI_IFC (IC1.37), TEC (IC12.3 R34.1 R35.2)
FREQ: SPI_IFC (IC1.34), TEC (IC6.1)
IO1: SPI_IFC (IC1.35), TEC (IC6.3)
MISO_ADC: SPI_IFC (IC1.45), TEC (IC11.9)
MISO_DAC: SPI_IFC (IC1.44), TEC (IC13.15)
SPI_CS2: TEC_driver (R1.2), SPI_IFC (IC1.52)
SPI_CS3: TEC_driver (R2.1), SPI_IFC (IC1.53)
TEC+: TEC_driver (P1.2), TEC (L2.4)
TEC-: TEC_driver (P1.1), TEC (L2.3)